# Altium schematic sheet TSE_battery_commutation_board.SchDoc
size 420 x 297 mm; SheetNumber: 1; SheetTotal: 1
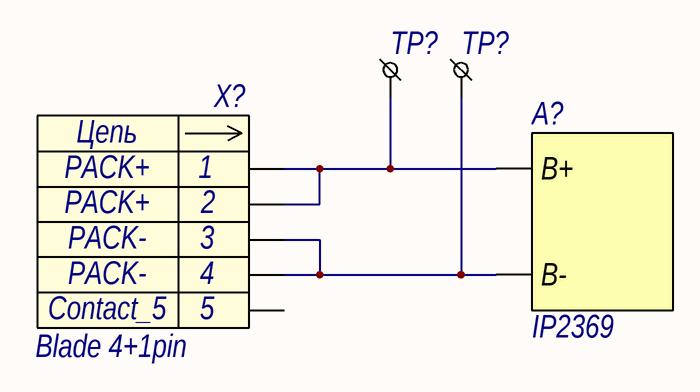
[diagram p0: TSE_battery_commutation_board.SchDoc]

## Parts
(Parts that share a designator on the sheet are numbered #1, #2 ... from top to bottom, then left to right.)
A?  IP2369
TP?#1  TESTPOINT  [TP_0,6X1]  (value not drawn)  (no BOM)
TP?#2  TESTPOINT  [TP_0,6X1]  (value not drawn)  (no BOM)
X?  Blade 4+1pin

## Nets
NetA?_1: A?.1(B+) TP?#1.1 X?.1 X?.2
NetA?_2: A?.2(B-) TP?#2.1 X?.3 X?.4

## Notes on the sheet
- Перв. примен.
- Справ. №
- Подп. и дата
- Инв. № дубл.
- Взам. инв. №
- Изм.
- Лист
- № докум.
- Подп.
- Дата
- Лит.
- Масса
- Масштаб
- Т.контр.
- Пров.
- Разраб.
- Листов
- Инв. № подл.
- Н.контр.
- Файл:
- Утв.
- Копировал
- Формат
- (in symbol Blade 4+1P M) Цепь; 5

## Library data of the parts
A? = IP2369: Power delivery модуль IP2369; Наименование: IP2369
TP?#1 TP?#2 = TESTPOINT_HOLE: Name: TESTPOINT
X? = Blade 4+1P M: Ножевой разъём - 4 конт. прямая вилка на плату с шагом 2.54мм; Contact_1: PACK+; Contact_3: PACK-; Contact_2: PACK+; Contact_4: PACK-; Наименование: Blade 4+1pin; Contact_5: Contact_5